# EAGLE design Lipo+ (EAGLE 6.5.0)
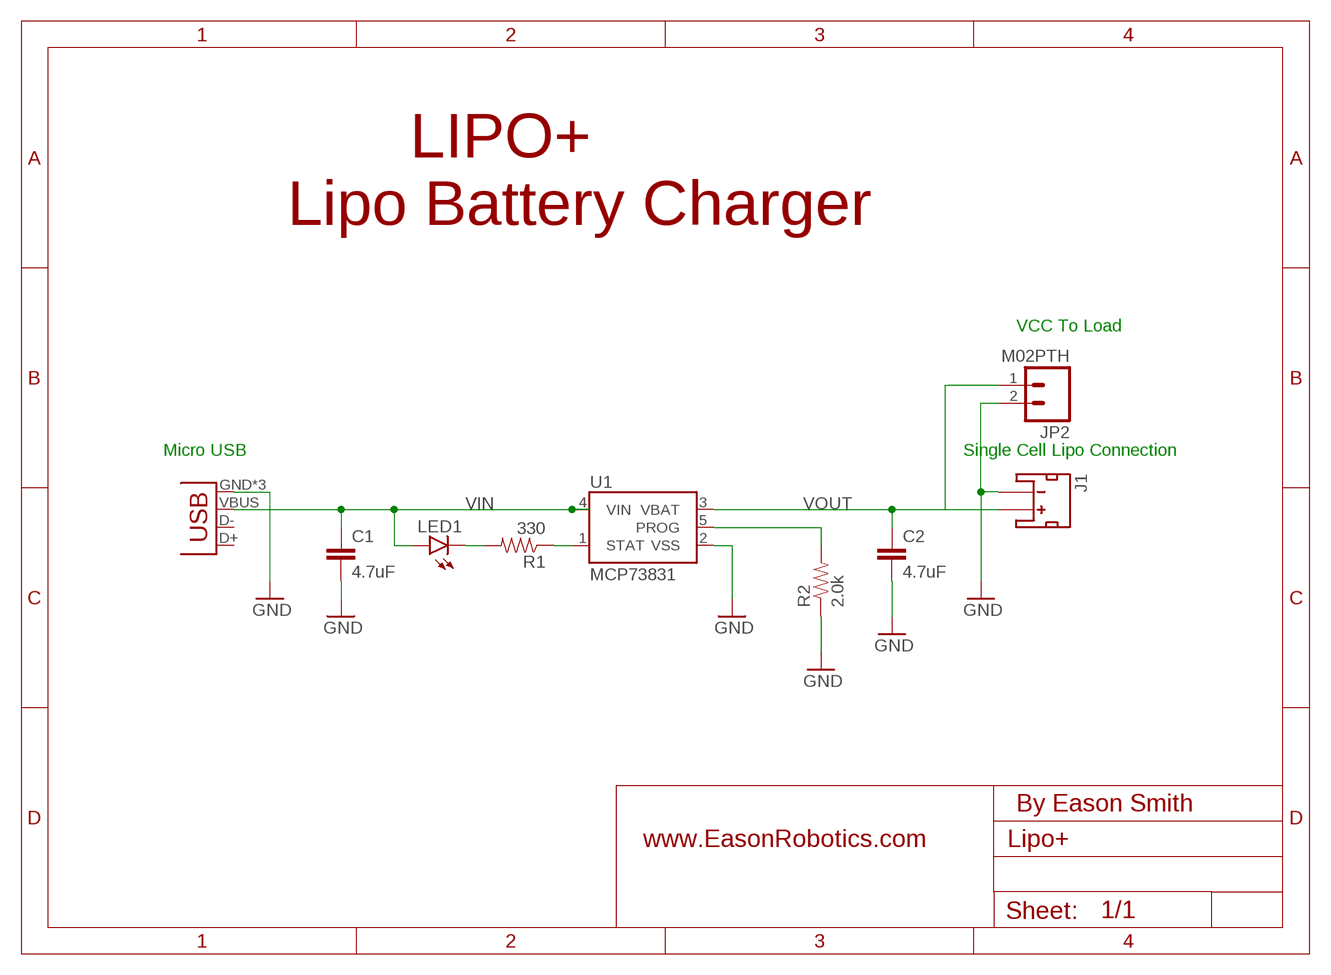
[diagram p0: schematic, sheet 1]

## Parts
C1  4.7uF  4.7UF-6.3V-10%(0603)0603  [0603-CAP]
C2  4.7uF  4.7UF-6.3V-10%(0603)0603  [0603-CAP]
J1  JST_2MM_MALE  [JST-2-SMD]
JP1  USB-MICROB  [USB-MICROB]
JP2  M02PTH  [1X02]
LED1  LED0603  [LED-0603]
R1  330  330OHM1/10W1%(0603)  [0603-RES]
R2  2.0k  2.0KOHM1/10W5%(0603)  [0603-RES]
U1  MCP73831  [SOT23-5]

## Nets
GND: C1.2 C2.2 J1.1(-) JP1.GND JP1.MT1(GND) JP1.MT2(GND) JP2.2 R2.1 U1.2(VSS)
N$1: R1.1 U1.1(STAT)
N$2: LED1.C R1.2
N$4: R2.2 U1.5(PROG)
VIN: C1.1 JP1.VBUS LED1.A U1.4(VIN)
VOUT: C2.1 J1.2(+) JP2.1 U1.3(VBAT)
Unconnected: J1.NC1(PAD1) J1.NC2(PAD2) JP1.D+ JP1.D-

## Notes on the sheet
- LIPO+  
  Lipo Battery Charger
- VCC To Load
- Micro USB | Single Cell Lipo Connection
- By Eason Smith
- www.EasonRobotics.com

## Library data of the parts
C1 C2 = SparkFun-Capacitors:4.7UF-6.3V-10%(0603): CAP-08280; PROD_ID: CAP-08280
J1 = SparkFun-Connectors:JST_2MM_MALE: Mates to single-cell LiPo batteries. CONN-08352; PROD_ID: CONN-08352
JP1 = SparkFun-Connectors:USB: USB Connectors USB-B-PTH is fully proven SKU : PRT-00139/CONN-08278 USB-miniB is fully proven SKU : PRT-00587 USB-A-PCB is untested. USB-A-H is throughly reviewed, but untested. Spark Fun Electronics SKU : PRT-00437 USB-B-SMT is throughly reviewed, but untested. Needs silkscreen touching up. USB-A-S has not been used/tested USB-MB-H has not been used/tested USB-MICROB has been used. CONN-09505; PROD_ID: CONN-09505
JP2 = SparkFun-Connectors:M02: Standard 2-pin 0.1" header. Use with - straight break away headers ( PRT-00116) - right angle break away headers (PRT-00553) - swiss pins (PRT-00743) - machine pins (PRT-00117) - female headers (PRT-00115) Molex polarized connector foot print use with: PRT-08233 with associated crimp pins and housings. 2.54_SCREWTERM for use with PRT-10571. 3.5mm Screw Terminal footprints for PRT-08084 5mm Screw Terminal footprints for use with PRT-08432
LED1 = SparkFun-LED:LED: LEDs Standard schematic elements and footprints for 5mm, 3mm, 1206, and 0603 sized LEDs. 5mm - Spark Fun Electronics SKU : COM-00529 (and others)
R1 = SparkFun-Resistors:330OHM1/10W1%(0603): RES-00818; PROD_ID: RES-00818
R2 = SparkFun-Resistors:2.0KOHM1/10W5%(0603): RES-08296; PROD_ID: RES-08296
U1 = SparkFun-PowerIC:MCP73831: Miniature single cell, fully integrated Li-Ion, Li-polymer charge management controller http://ww1.microchip.com/downloads/en/DeviceDoc/21984a.pdf IC-09995; PROD_ID: IC-09995

## Board
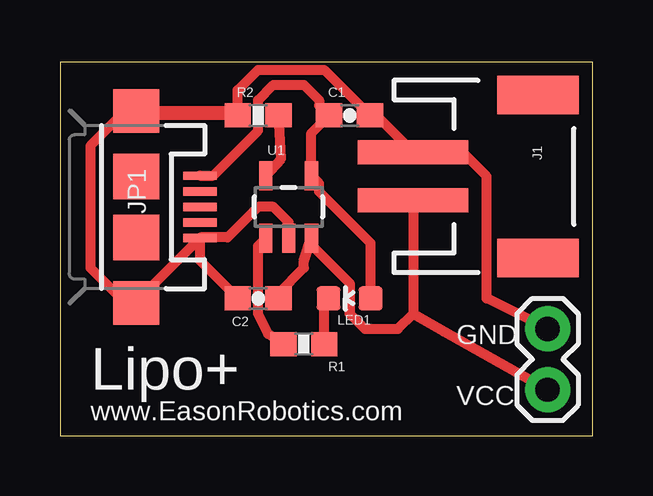
[diagram p1: board, top side]

Size 22.2 x 15.55 mm. Coordinates in mm from the lower left corner, seen from the top.
Outline: 0,0 22.2,0 22.2,15.55 0,15.55 0,0
Copper layers (1*16): Top 0.035mm / dielectric 1.5mm / Bottom 0.035mm
Design rules "default": minimum track width 10mil, minimum drill 24mil, track to track 8mil, track to pad 8mil, pad to pad 8mil, via to via 8mil, smd to smd 8mil, copper to edge 40mil, drill to drill 8mil, minimum pad ring 10mil, minimum via ring 8mil, stop-mask expansion 4mil, vias tented up to drill 0mil, thermal gap 10mil

### Footprints (pad centres in the part's own frame; a part is rotated, then mirrored left to right if it is on the bottom)
0603-CAP = smd 1.1 x 1: 1 -0.85,0; 2 0.85,0
JST-2-SMD = smd 1 x 4.6: 1 -1,-3.7; 2 1,-3.7 | smd 1.6 x 3.4: NC1 -3.4,1.5; NC2 3.4,1.5
USB-MICROB = smd 0.35 x 1.4: D+ 0,2.65; D- -0.65,2.65; GND 1.3,2.65; ID 0.65,2.65; VBUS -1.3,2.65 | smd 1.8 x 1.9: MT1 -4,0; MT2 4,0 | smd 1.9 x 1.9: P$1 -1.27,0; P$2 1.27,0
1X02 = drill 1.016 pad 1.88: 1 0,0; 2 2.54,0
LED-0603 = smd 1 x 1: A 0,-0.877; C 0,0.877
0603-RES = smd 1.1 x 1: 1 -0.85,0; 2 0.85,0
SOT23-5 = smd 0.55 x 1.2: 1 -0.95,-1.3; 2 0,-1.3; 3 0.95,-1.3; 4 0.95,1.3; 5 -0.95,1.3

### Placement (x,y rotation side)
C1  12.06,13.34 0 top
C2  8.25,5.71 180 top
J1  18.41,10.8 270 top
JP1  3.17,9.52 270 top
JP2  20.32,1.91 90 top
LED1  12.06,5.71 90 top
R1  10.16,3.81 0 top
R2  8.25,13.34 0 top
U1  9.52,9.52 0 top

### Tracks (layer width: path | path; a pad name or v marks a point on that pad's centre or on a via)
GND
  Top 0.406: JP1.MT1 7.21,13.52 R2.1 | JP1.GND 3.31,5.71 3.17,5.71 JP1.MT2 2.98,5.71 2.54,5.71 1.27,6.98 1.27,12.06 2.54,13.34 R2.1 | JP1.GND 5.82,7.3 C2.2 | JP2.2 17.78,5.71 17.78,10.8 16.51,12.06 15.08,12.06 J1.1 13.17,13.34 C1.2 11.01,15.24 8.25,15.24 7.41,14.39 R2.1 | U1.2 9.52,8.89 8.89,9.52 8.25,9.52 6.98,8.25 5.85,8.25 JP1.GND | R2.1 7.41,13.12
N$1
  Top 0.406: R1.1 8.67,4.23 8.25,5.08 8.25,7.91 U1.1
N$2
  Top 0.406: R1.2 11.01,5.54 LED1.C
N$4
  Top 0.406: U1.5 9.21,11.53 R2.2
VIN
  Top 0.406: LED1.A 12.94,8.01 10.8,10.16 10.8,10.5 U1.4 10.48,12.59 C1.1 10.8,13.75 10.8,13.97 10.16,14.6 8.89,14.6 8.25,13.97 8.25,12.7 6.38,10.82 JP1.VBUS
VOUT
  Top 0.406: C2.1 9.1,5.93 10.16,6.98 10.16,7.27 U1.3 10.48,7.94 12.06,6.35 12.06,5.08 12.7,4.45 14.08,4.45 14.71,5.08 | J1.2 14.71,5.08 | 14.71,5.08 15.98,4.34 JP2.1

### Text on the board
tNames: GND | Lipo+ | VCC | www.EasonRobotics.com